# Altium project mainboard.PrjPCB
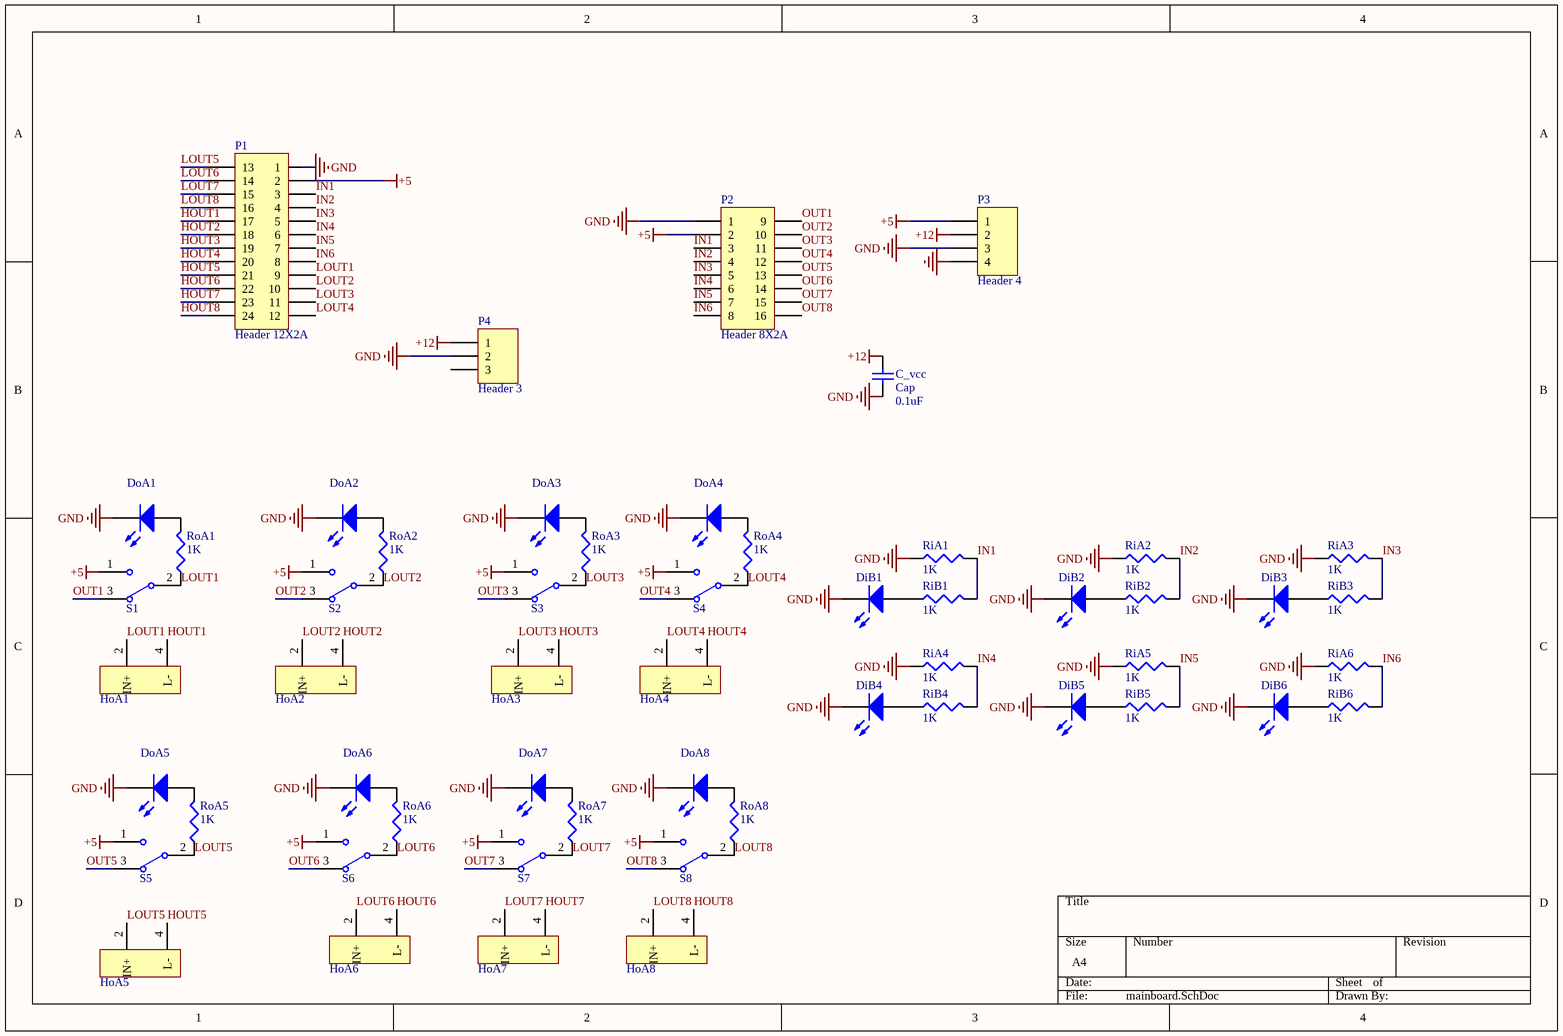
[diagram p0: mainboard.SchDoc]
1 sheet, 55 parts. Net scope: global (net labels, ports and power ports of the same name join across sheets).
Board file: mainboard.PcbDoc

## Sheet mainboard.SchDoc
size A4

### Parts
C_vcc  Cap  value 0.1uF  [0805C]
DiB1  LED1  [LED0805]  (value not drawn)
DiB2  LED1  [LED0805]  (value not drawn)
DiB3  LED1  [LED0805]  (value not drawn)
DiB4  LED1  [LED0805]  (value not drawn)
DiB5  LED1  [LED0805]  (value not drawn)
DiB6  LED1  [LED0805]  (value not drawn)
DoA1  LED1  [LED0805]  (value not drawn)
DoA2  LED1  [LED0805]  (value not drawn)
DoA3  LED1  [LED0805]  (value not drawn)
DoA4  LED1  [LED0805]  (value not drawn)
DoA5  LED1  [LED0805]  (value not drawn)
DoA6  LED1  [LED0805]  (value not drawn)
DoA7  LED1  [LED0805]  (value not drawn)
DoA8  LED1  [LED0805]  (value not drawn)
HoA1  H3MB-052D  [H3MB-052D]  (value not drawn)
HoA2  H3MB-052D  [H3MB-052D]  (value not drawn)
HoA3  H3MB-052D  [H3MB-052D]  (value not drawn)
HoA4  H3MB-052D  [H3MB-052D]  (value not drawn)
HoA5  H3MB-052D  [H3MB-052D]  (value not drawn)
HoA6  H3MB-052D  [H3MB-052D]  (value not drawn)
HoA7  H3MB-052D  [H3MB-052D]  (value not drawn)
HoA8  H3MB-052D  [H3MB-052D]  (value not drawn)
P1  Header 12X2A  [HDR2X12_CEN]
P2  Header 8X2A  [HDR2X8_CEN]
P3  Header 4  [HDR1X4]
P4  Header 3  [DC005]
RiA1  value 1K  [RESC0805]  (hidden comment: Res3)
RiA2  value 1K  [RESC0805]  (hidden comment: Res3)
RiA3  value 1K  [RESC0805]  (hidden comment: Res3)
RiA4  value 1K  [RESC0805]  (hidden comment: Res3)
RiA5  value 1K  [RESC0805]  (hidden comment: Res3)
RiA6  value 1K  [RESC0805]  (hidden comment: Res3)
RiB1  value 1K  [RESC0805]  (hidden comment: Res3)
RiB2  value 1K  [RESC0805]  (hidden comment: Res3)
RiB3  value 1K  [RESC0805]  (hidden comment: Res3)
RiB4  value 1K  [RESC0805]  (hidden comment: Res3)
RiB5  value 1K  [RESC0805]  (hidden comment: Res3)
RiB6  value 1K  [RESC0805]  (hidden comment: Res3)
RoA1  value 1K  [RESC0805]  (hidden comment: Res3)
RoA2  value 1K  [RESC0805]  (hidden comment: Res3)
RoA3  value 1K  [RESC0805]  (hidden comment: Res3)
RoA4  value 1K  [RESC0805]  (hidden comment: Res3)
RoA5  value 1K  [RESC0805]  (hidden comment: Res3)
RoA6  value 1K  [RESC0805]  (hidden comment: Res3)
RoA7  value 1K  [RESC0805]  (hidden comment: Res3)
RoA8  value 1K  [RESC0805]  (hidden comment: Res3)
S1  SW-SPDT  [HDR1X3]  (value not drawn)
S2  SW-SPDT  [HDR1X3]  (value not drawn)
S3  SW-SPDT  [HDR1X3]  (value not drawn)
S4  SW-SPDT  [HDR1X3]  (value not drawn)
S5  SW-SPDT  [HDR1X3]  (value not drawn)
S6  SW-SPDT  [HDR1X3]  (value not drawn)
S7  SW-SPDT  [HDR1X3]  (value not drawn)
S8  SW-SPDT  [HDR1X3]  (value not drawn)

### Nets
+5: P1.2 P2.2 P3.1 S1.1 S2.1 S3.1 S4.1 S5.1 S6.1 S7.1 S8.1
+12: C_vcc.2 HoA1.3(L+) HoA2.3(L+) HoA3.3(L+) HoA4.3(L+) HoA5.3(L+) HoA6.3(L+) HoA7.3(L+) HoA8.3(L+) P3.2 P4.1
GND: C_vcc.1 DiB1.2(K) DiB2.2(K) DiB3.2(K) DiB4.2(K) DiB5.2(K) DiB6.2(K) DoA1.2(K) DoA2.2(K) DoA3.2(K) DoA4.2(K) DoA5.2(K) DoA6.2(K) DoA7.2(K) DoA8.2(K) HoA1.1(IN-) HoA2.1(IN-) HoA3.1(IN-) HoA4.1(IN-) HoA5.1(IN-) HoA6.1(IN-) HoA7.1(IN-) HoA8.1(IN-) P1.1 P2.1 P3.3 P3.4 P4.2 RiA1.1 RiA2.1 RiA3.1 RiA4.1 RiA5.1 RiA6.1
HOUT1: HoA1.4(L-) P1.17
HOUT2: HoA2.4(L-) P1.18
HOUT3: HoA3.4(L-) P1.19
HOUT4: HoA4.4(L-) P1.20
HOUT5: HoA5.4(L-) P1.21
HOUT6: HoA6.4(L-) P1.22
HOUT7: HoA7.4(L-) P1.23
HOUT8: HoA8.4(L-) P1.24
IN1: P1.3 P2.3 RiA1.2 RiB1.2
IN2: P1.4 P2.4 RiA2.2 RiB2.2
IN3: P1.5 P2.5 RiA3.2 RiB3.2
IN4: P1.6 P2.6 RiA4.2 RiB4.2
IN5: P1.7 P2.7 RiA5.2 RiB5.2
IN6: P1.8 P2.8 RiA6.2 RiB6.2
LOUT1: HoA1.2(IN+) P1.9 RoA1.1 S1.2
LOUT2: HoA2.2(IN+) P1.10 RoA2.1 S2.2
LOUT3: HoA3.2(IN+) P1.11 RoA3.1 S3.2
LOUT4: HoA4.2(IN+) P1.12 RoA4.1 S4.2
LOUT5: HoA5.2(IN+) P1.13 RoA5.1 S5.2
LOUT6: HoA6.2(IN+) P1.14 RoA6.1 S6.2
LOUT7: HoA7.2(IN+) P1.15 RoA7.1 S7.2
LOUT8: HoA8.2(IN+) P1.16 RoA8.1 S8.2
OUT1: P2.9 S1.3
OUT2: P2.10 S2.3
OUT3: P2.11 S3.3
OUT4: P2.12 S4.3
OUT5: P2.13 S5.3
OUT6: P2.14 S6.3
OUT7: P2.15 S7.3
OUT8: P2.16 S8.3
NetDiB1_1: DiB1.1(A) RiB1.1
NetDiB2_1: DiB2.1(A) RiB2.1
NetDiB3_1: DiB3.1(A) RiB3.1
NetDiB4_1: DiB4.1(A) RiB4.1
NetDiB5_1: DiB5.1(A) RiB5.1
NetDiB6_1: DiB6.1(A) RiB6.1
NetDoA1_1: DoA1.1(A) RoA1.2
NetDoA2_1: DoA2.1(A) RoA2.2
NetDoA3_1: DoA3.1(A) RoA3.2
NetDoA4_1: DoA4.1(A) RoA4.2
NetDoA5_1: DoA5.1(A) RoA5.2
NetDoA6_1: DoA6.1(A) RoA6.2
NetDoA7_1: DoA7.1(A) RoA7.2
NetDoA8_1: DoA8.1(A) RoA8.2

Not connected (* = marked no-connect by the designer): P4 3

### Library data of the parts
C_vcc = Cap: Capacitor; Published: 8-Jun-2000; LatestRevisionDate: 17-Jul-2002; LatestRevisionNote: Re-released for DXP Platform.; PackageReference: RAD-0.3; Publisher: Altium Limited
DiB1-DiB6 DoA1-DoA8 = LED1: Typical RED GaAs LED; Published: 8-Jun-2000; LatestRevisionDate: 08-Jul-2005; LatestRevisionNote: Mech Layer 1 removed.; PackageReference: LED-1; Publisher: Altium Limited
P1 = Header 12X2A: Header, 12-Pin, Dual row; LatestRevisionDate: 17-Jul-2002; LatestRevisionNote: Re-released for DXP Platform.; Publisher: Altium Limited
P2 = Header 8X2A: Header, 8-Pin, Dual row; LatestRevisionDate: 17-Jul-2002; LatestRevisionNote: Re-released for DXP Platform.; Publisher: Altium Limited
P3 = Header 4: Header, 4-Pin; LatestRevisionDate: 17-Jul-2002; LatestRevisionNote: Re-released for DXP Platform.; Publisher: Altium Limited
P4 = Header 3: Header, 3-Pin; LatestRevisionDate: 17-Jul-2002; LatestRevisionNote: Re-released for DXP Platform.; Publisher: Altium Limited
RiA1-RiA6 RiB1-RiB6 RoA1-RoA8 = Res3: Resistor; Published: 8-Jun-2000; LatestRevisionDate: 29-May-2009; LatestRevisionNote: IPC-7351 Footprint Added.; PackageReference: J1-0603; Publisher: Altium Limited; PackageDescription: Chip Resistor
S1-S8 = SW-SPDT: SPDT Subminiature Toggle Switch, Right Angle Mounting, Vertical Actuation; Published: 24-Mar-1999; LatestRevisionDate: 17-Dec-2003; LatestRevisionNote: Schematic revised, PCB Footprint replaced.; DatasheetVersion: 05-Dec-2000; PackageReference: TL36WW15050; Publisher: Altium Limited; ComponentLink1Description: Manufacturer Link; ComponentLink1URL: http://www.apem.com